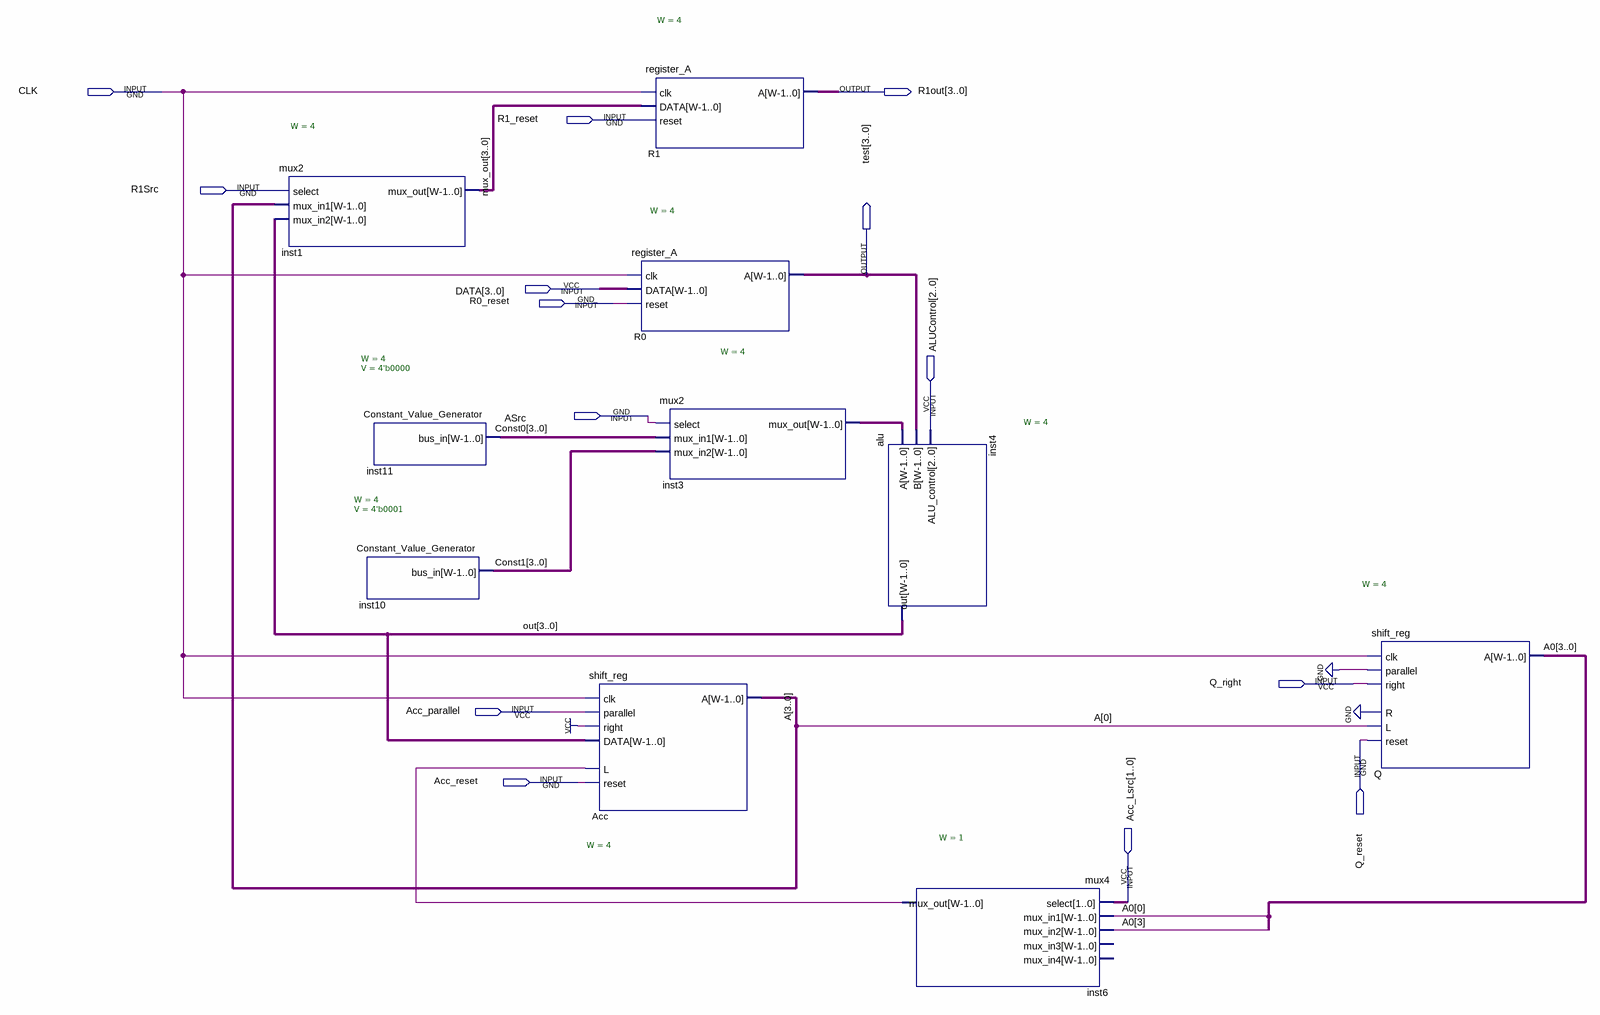
[diagram p0: schematic sheet]
// Quartus schematic DATAPATH.bdf as structural Verilog: 10 symbols, 14 pins
module DATAPATH (
  input  CLK,
  input  R1_reset,
  input  R1Src,
  input  [3:0] DATA,
  input  R0_reset,
  input  ASrc,
  input  [2:0] ALUControl,
  input  Q_right,
  input  Acc_parallel,
  input  Q_reset,
  input  Acc_reset,
  input  [1:0] Acc_Lsrc,
  output [3:0] R1out,
  output [3:0] test
);

  wire inst6_mux_out;
  wire [3:0] A, A0, Const0, Const1, inst3_mux_out, mux_out, out;

  mux2 #(.W(4)) inst1 (.select(R1Src), .mux_in1(A), .mux_in2(out), .mux_out(mux_out));
  Constant_Value_Generator #(.W(4), .V(4'b0000)) inst11 (.bus_in(Const0));
  Constant_Value_Generator #(.W(4), .V(4'b0001)) inst10 (.bus_in(Const1));
  shift_reg #(.W(4)) Acc (
    .DATA(out), .L(inst6_mux_out), .clk(CLK), .parallel(Acc_parallel), .reset(Acc_reset), .right(1'b1), .A(A));
  register_A #(.W(4)) R1 (.clk(CLK), .DATA(mux_out), .reset(R1_reset), .A(R1out));
  register_A #(.W(4)) R0 (.clk(CLK), .DATA(DATA), .reset(R0_reset), .A(test));
  mux2 #(.W(4)) inst3 (.select(ASrc), .mux_in1(Const0), .mux_in2(Const1), .mux_out(inst3_mux_out));
  alu #(.W(4)) inst4 (.ALU_control(ALUControl), .A(inst3_mux_out), .B(test), .out(out));
  mux4 #(.W(1)) inst6 (
    .select(Acc_Lsrc), .mux_in1(A0[0]), .mux_in2(A0[3]), .mux_out(inst6_mux_out));  // open: mux_in3, mux_in4
  shift_reg #(.W(4)) Q (.L(A[0]), .R(1'b0), .clk(CLK), .parallel(1'b0), .reset(Q_reset), .right(Q_right), .A(A0));
endmodule
